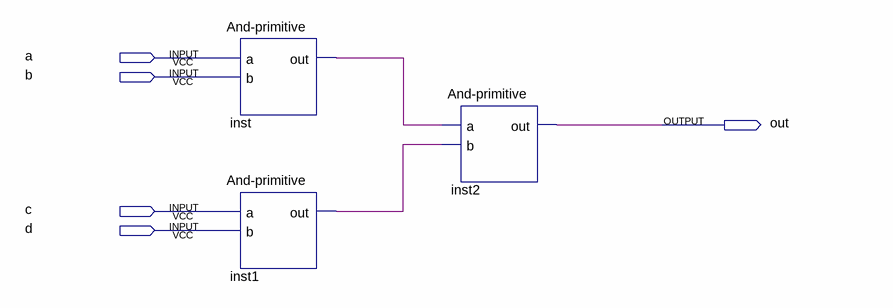
[diagram p0: schematic sheet]
// Quartus schematic And4-primitive.bdf as structural Verilog: 3 symbols, 5 pins
module \And4-primitive  (
  input  a,
  input  b,
  input  c,
  input  d,
  output out
);

  wire inst1_out, inst_out;

  \And-primitive  inst (.a(a), .b(b), .out(inst_out));
  \And-primitive  inst1 (.a(c), .b(d), .out(inst1_out));
  \And-primitive  inst2 (.a(inst_out), .b(inst1_out), .out(out));
endmodule
